# EAGLE design ESP_Bare_v2 (EAGLE 9.3.1)
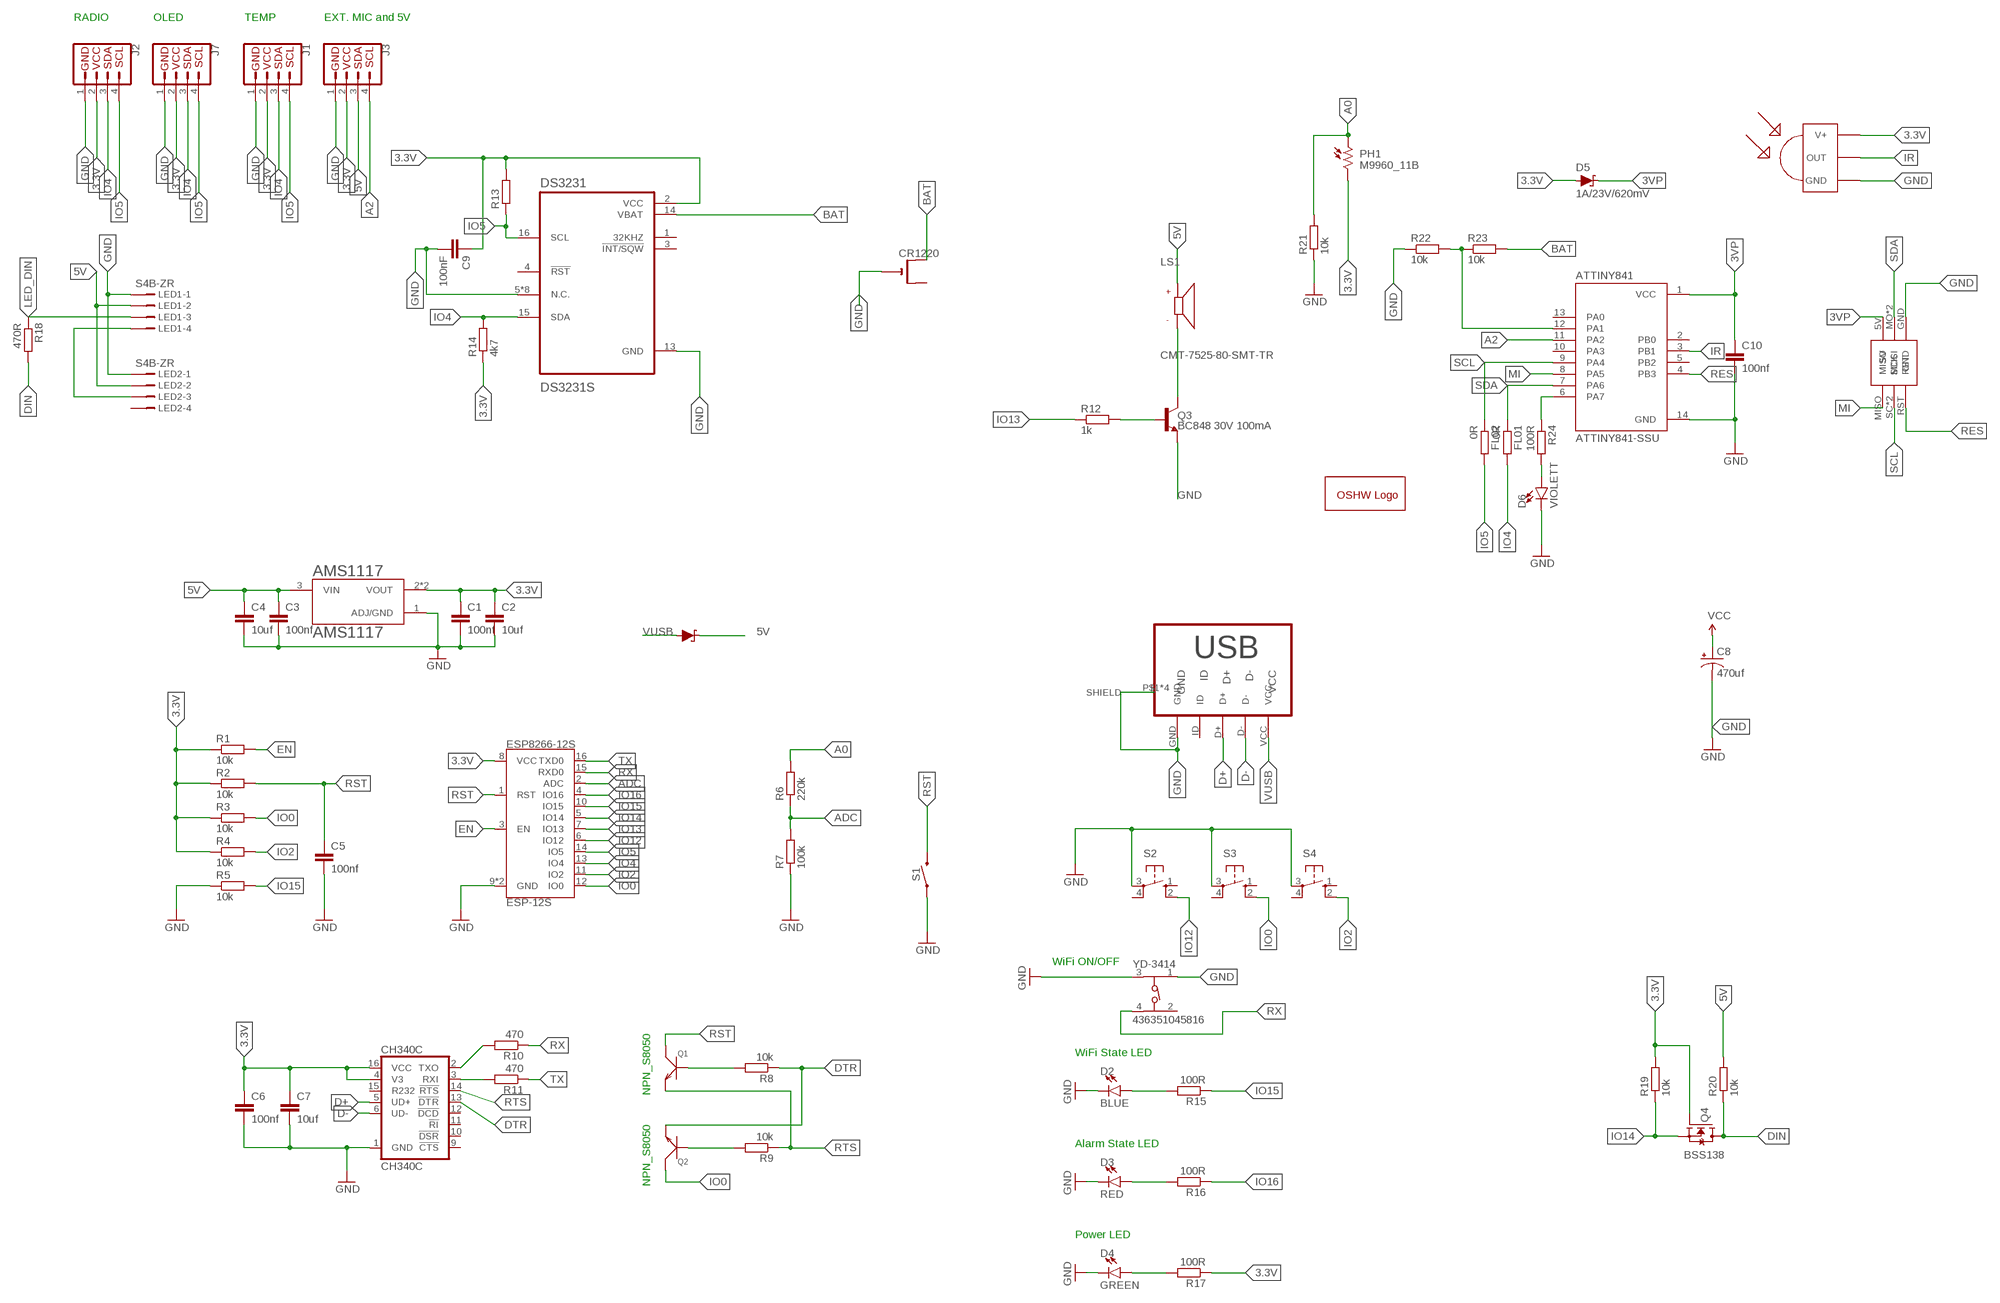
[diagram p0: schematic, sheet 1]

## Parts
AMS1117  AMS1117  [SOT229P700X180-4N]
ATTINY841  ATTINY841-SSU  [SOIC127P599X175-14N]
C1  100nf  C-EUC0603  [C0603]
C2  10uf  C-EUC0805  [C0805]
C3  100nf  C-EUC0603  [C0603]
C4  10uf  C-EUC0805  [C0805]
C5  100nf  C-EUC0603  [C0603]
C6  100nf  C-EUC0603  [C0603]
C7  10uf  C-EUC0603  [C0603]
C8  470uf  CAP_POL7343  [EIA7343]
C9  100nF  C-EUC0603  [C0603]
C10  100nf  C-EUC0603  [C0603]
CH340C  CH340C  [SO016]
CR1220  CR1220SMT  [CR1220-SMD]
D1  MBR130T1G, SL; SOD123 or SMA, 1A  DIODE-SCHOTTKY-B340A  [SMA-DIODE]
D2  BLUE  LED-BLUE0603  [LED-0603]
D3  RED  LED-BLUE0603  [LED-0603]
D4  GREEN  LED-BLUE0603  [LED-0603]
D5  1A/23V/620mV  DIODE-SCHOTTKY-BAT20J  [SOD-323]
D6  VIOLETT  LED-BLUE0603  [LED-0603]
DS3231  DS3231S  [SOIC127P1032X265-16N]
ESP8266-12S  ESP-12S  [ESP-12S]
FL01  0R  R-EU_R0603  [R0603]
FL02  0R  R-EU_R0603  [R0603]
GOLD_ORB_SM1  OSHWLOGOLOGO5MM  [OSHW_5MM]
J1  QWIIC_CONNECTORJS-1MM  [1X04_1MM_RA]
J2  QWIIC_CONNECTORJS-1MM  [1X04_1MM_RA]
J3  QWIIC_CONNECTORJS-1MM  [1X04_1MM_RA]
J7  QWIIC_CONNECTORJS-1MM  [1X04_1MM_RA]
LED1  S4B-ZR  [S4B-ZR]
LED2  S4B-ZR  [S4B-ZR]
LS1  CMT-7525-80-SMT-TR  [XDCR_CMT-7525-80-SMT-TR]
MICRO-USB  MICRO-USB-B  [MICRO_USB_4_LEGS]
PH1  M9960_11B  [M9960]
Q1  NPN_S8050  SMD-TRANSISTORS-NPN-25V-500MW(SOT-23)  [SOT-23]
Q2  NPN_S8050  SMD-TRANSISTORS-NPN-25V-500MW(SOT-23)  [SOT-23]
Q3  BC848 30V 100mA  TRANS_NPN-MMBT2222AL  [SOT23-3]
Q4  BSS138  [SOT95P240X111-3N]
R1  10k  R-EU_R0603  [R0603]
R2  10k  R-EU_R0603  [R0603]
R3  10k  R-EU_R0603  [R0603]
R4  10k  R-EU_R0603  [R0603]
R5  10k  R-EU_R0603  [R0603]
R6  220k  R-EU_R0603  [R0603]
R7  100k  R-EU_R0603  [R0603]
R8  10k  R-EU_R0603  [R0603]
R9  10k  R-EU_R0603  [R0603]
R10  470  R-EU_R0603  [R0603]
R11  470  R-EU_R0603  [R0603]
R12  1k  R-EU_R0603  [R0603]
R13  4k7  R-EU_R0603  [R0603]
R14  4k7  R-EU_R0603  [R0603]
R15  100R  R-EU_R0603  [R0603]
R16  100R  R-EU_R0603  [R0603]
R17  100R  R-EU_R0603  [R0603]
R18  470R  R-EU_R0603  [R0603]
R19  10k  R-EU_R0603  [R0603]
R20  10k  R-EU_R0603  [R0603]
R21  10k  R-EU_R0603  [R0603]
R22  10k  R-EU_R0603  [R0603]
R23  10k  R-EU_R0603  [R0603]
R24  100R  R-EU_R0603  [R0603]
S1  MOMENTARY-SWITCH-SPST-SMD-4.6X2.8MM  [TACTILE_SWITCH_SMD_4.6X2.8MM]
S2  10-XX  [B3F-10XX]
S3  10-XX  [B3F-10XX]
S4  10-XX  [B3F-10XX]
U$1  ISCP_PORTPOGONEW  [ISCP_PADS_2ROW2HNEW]
U$2  TSOP4838  [TSOP18XX]
YD-3414  436351045816  [4363X10458XX]

## Nets
3.3V: AMS1117.2(VOUT) AMS1117.4(VOUT) C1.1 C2.1 C6.1 C7.1 C9.1 CH340C.4(V3) CH340C.16(VCC) D5.A DS3231.2(VCC) ESP8266-12S.8(VCC) J1.2(VCC) J2.2(VCC) J3.2(VCC) J7.2(VCC) PH1.2 Q4.1(G) R1.1 R2.1 R3.1 R4.1 R13.2 R14.1 R17.1 R19.2 U$2.VCC(V+)
3VP: ATTINY841.1(VCC) C10.1 D5.C U$1.5V
5V: AMS1117.3(VIN) C3.1 C4.1 C8.A(+) D1.C J3.3(SDA) LED1.2 LED2.2 LS1.P R20.2 ; supply symbol labelled VCC
A0: PH1.1 R6.2 R21.2
A2: ATTINY841.11(PA2) J3.4(SCL)
ADC: ESP8266-12S.2(ADC) R6.1 R7.2
BAT: CR1220.+$1(+) DS3231.14(VBAT) R23.2
D+: CH340C.5(UD+) MICRO-USB.D+
D-: CH340C.6(UD-) MICRO-USB.D-
DIN: Q4.3(D) R18.2 R20.1
DTR: CH340C.13(!DTR) Q2.2(E) R8.1
EN: ESP8266-12S.3(EN) R1.2
GND: AMS1117.1(ADJ/GND) ATTINY841.14(GND) C1.2 C2.2 C3.2 C4.2 C5.2 C6.2 C7.2 C8.C(-) C9.2 C10.2 CH340C.1(GND) CR1220.- D2.C D3.C D4.C D6.C DS3231.5(N.C.) DS3231.6(N.C.) DS3231.7(N.C.) DS3231.8(N.C.) DS3231.9(N.C.) DS3231.10(N.C.) DS3231.11(N.C.) DS3231.12(N.C.) DS3231.13(GND) ESP8266-12S.9(GND) ESP8266-12S.P$1(GND) J1.1(GND) J2.1(GND) J3.1(GND) J7.1(GND) LED1.1 LED2.1 MICRO-USB.GND MICRO-USB.P$1(SHIELD) MICRO-USB.P$2(SHIELD) MICRO-USB.P$3(SHIELD) MICRO-USB.P$5(SHIELD) Q3.2(E) R5.1 R7.1 R21.1 R22.1 S1.1 S1.2 S2.3(P) S3.3(P) S4.3(P) U$1.GND U$2.GND YD-3414.1 YD-3414.3
IO0: ESP8266-12S.12(IO0) Q2.3(C) R3.2 S3.2(S1)
IO2: ESP8266-12S.11(IO2) R4.2 S4.2(S1)
IO4: DS3231.15(SDA) ESP8266-12S.13(IO4) FL01.2 J1.3(SDA) J2.3(SDA) J7.3(SDA) R14.2
IO5: DS3231.16(SCL) ESP8266-12S.14(IO5) FL02.2 J1.4(SCL) J2.4(SCL) J7.4(SCL) R13.1
IO12: ESP8266-12S.6(IO12) S2.2(S1)
IO13: ESP8266-12S.7(IO13) R12.1
IO14: ESP8266-12S.5(IO14) Q4.2(S) R19.1
IO15: ESP8266-12S.10(IO15) R5.2 R15.1
IO16: ESP8266-12S.4(IO16) R16.1
IR: ATTINY841.3(PB1) U$2.OUT
LED_DIN: LED1.3 R18.1
MI: ATTINY841.8(PA5) U$1.MISO
N$1: Q3.1(B) R12.2
N$2: LED1.4 LED2.3
N$3: Q1.1(B) R8.2
N$4: Q2.1(B) R9.2
N$5: ATTINY841.12(PA1) R22.2 R23.1
N$6: D6.A R24.2
N$7: ATTINY841.6(PA7) R24.1
N$8: D3.A R16.2
N$9: D2.A R15.2
N$10: D4.A R17.2
N$11: CH340C.3(RXI) R11.2
N$12: CH340C.2(TXO) R10.2
N$13: LS1.N Q3.3(C)
RES: ATTINY841.4(PB3) U$1.RST
RST: C5.1 ESP8266-12S.1(RST) Q1.3(C) R2.2 S1.3 S1.4
RTS: CH340C.14(!RTS) Q1.2(E) R9.1
RX: ESP8266-12S.15(RXD0) R10.1 YD-3414.4
SCL: ATTINY841.9(PA4) FL02.1 U$1.SC(SCK) U$1.SCK
SDA: ATTINY841.7(PA6) FL01.1 U$1.MO(MOSI) U$1.MOSI
TX: ESP8266-12S.16(TXD0) R11.1
VUSB: D1.A MICRO-USB.VCC
Unconnected: ATTINY841.2(PB0) ATTINY841.5(PB2) ATTINY841.10(PA3) ATTINY841.13(PA0) CH340C.9(!CTS) CH340C.10(!DSR) CH340C.11(!RI) CH340C.12(!DCD) CH340C.15(R232) CR1220.+$2(+1) DS3231.1(32KHZ) DS3231.3(!INT/SQW) DS3231.4(!RST) LED2.4 MICRO-USB.ID S2.1(S) S2.4(P1) S3.1(S) S3.4(P1) S4.1(S) S4.4(P1) YD-3414.2

## Notes on the sheet
- RADIO | OLED | TEMP | EXT. MIC and 5V
- WiFi ON/OFF
- NPN_S8050
- WiFi State LED
- NPN_S8050
- Alarm State LED
- Power LED

## Library data of the parts
AMS1117 = AMS1117:AMS1117: Sot223/Pkg 1-Amp 5-Volt Low Drop Out Voltage Regulatator; AVAILABILITY: Unavailable; DESCRIPTION: 1A LOW DROPOUT VOLTAGE REGULATOR SOT-223; MF: Advanced Monolithic Systems; MP: AMS1117; PACKAGE: SOT-223 Seeed Technology; PRICE: None
ATTINY841 = ATTINY841-SSU:ATTINY841-SSU: MCU 8-bit ATtiny AVR CISC 8KB Flash 1.8V/2.5V/3.3V/5V 14-Pin SOIC W Tray Check prices <https://pricing.snapeda.com/parts/ATTINY841-SSU/Microchip/view-part?ref=eda>; AVAILABILITY: Good; DESCRIPTION: AVR AVR® ATtiny Microcontroller IC 8-Bit 16MHz 8KB (8K x 8) FLASH 14-SOIC; MF: Microchip; MP: ATTINY841-SSU; PACKAGE: SOIC-14 Microchip; PRICE: None; PURCHASE-URL: https://pricing.snapeda.com/search/part/ATTINY841-SSU/?ref=eda
C1-C7 C9 C10 = resistor:C-EU: CAPACITOR, European symbol
C8 = SparkFun-Passives:CAP_POL: Capacitor Polarized These are standard SMD and PTH capacitors. Normally 10uF, 47uF, and 100uF in electrolytic and tantalum varieties. Always verify the external diameter of the through hole cap, it varies with capacity, voltage, and manufacturer. The EIA devices should be standard.
CH340C = CH340C:CH340C; AVAILABILITY: Unavailable; DESCRIPTION: USB to serial chip CH340; MF: WCH; MP: CH340C; PACKAGE: Package; PRICE: None
CR1220 = adafruit:CR1220: CR1216/CR1220/CR1225 12mm 3V lithium coin cell Great for battery packup. Both SMT and THM holders. Note the THM package has the ground pads on both sides of the PCB so that the masks are the same - this reduces the cost
D1 = SparkFun-DiscreteSemi:DIODE-SCHOTTKY: Schottky diode A Schottky diode is a semiconductor diode which has a low forward voltage drop and a very fast switching action.; PROD_ID: DIO-09886; VALUE: 3A/40V/500mV
D2 = SparkFun-LED:LED-BLUE: Blue SMD LED Used in manufacturing of various products at SparkFun Packages: 0603 - SMD 0603 package [Product Link] <http://www.digikey.com/product-detail/en/SMLE12BC7TT86/511-1589-2-ND/1641808> 1206 - SMD1206 package [Product Link] <http://www.digikey.com/product-detail/en/lite-on-inc/LTST-C150TBKT/160-1643-1-ND/573584> SparkFun Products: ESP8266 Thing-Dev Board <https://www.sparkfun.com/products/13711> RedBoard <https://www.sparkfun.com/products/12757>; PROD_ID: DIO-08575
D3 D4 D6 = SparkFun-LED:LED-BLUE: Blue SMD LED Used in manufacturing of various products at SparkFun Packages: 0603 - SMD 0603 package [Product Link] <http://www.digikey.com/product-detail/en/SMLE12BC7TT86/511-1589-2-ND/1641808> 1206 - SMD1206 package [Product Link] <http://www.digikey.com/product-detail/en/lite-on-inc/LTST-C150TBKT/160-1643-1-ND/573584> SparkFun Products: ESP8266 Thing-Dev Board <https://www.sparkfun.com/products/13711> RedBoard <https://www.sparkfun.com/products/12757>; PROD_ID: DIO-08575; VALUE: BLUE
D5 = SparkFun-DiscreteSemi:DIODE-SCHOTTKY: Schottky diode A Schottky diode is a semiconductor diode which has a low forward voltage drop and a very fast switching action.; PROD_ID: DIO-11623
DS3231 = DS3231S:DS3231S: Check prices <https://pricing.snapeda.com/parts/DS3231S/Maxim%20Integrated/view-part?ref=eda>; AVAILABILITY: Warning; DESCRIPTION: Real Time Clock (RTC) IC Clock/Calendar I²C, 2-Wire Serial 16-SOIC (0.295, 7.50mm Width); MF: Maxim Integrated; MP: DS3231S; PACKAGE: SOIC-16 Maxim Integrated; PRICE: None; PURCHASE-URL: https://pricing.snapeda.com/search/part/DS3231S/?ref=eda
ESP8266-12S = ESP-12S:ESP-12S: AI-Thinker ESP-12S ESP-12S WiFi module is developed by AI-Thinker Co.,Ltd, core processor ESP8266 in smaller sizes of the module encapsulates Tensilica L106 integrates industry-leading ultra low power 32-bit MCU micro, with the 16-bit short mode, clock speed support 80 MHz, 160 MHz, supports the RTOS, integrated Wi-Fi MAC/BB/RF/PA/LNA, on-board antennas. Check prices <https://pricing.snapeda.com/parts/ESP-12S/RF%20Solutions/view-part?ref=eda>; AVAILABILITY: Bad; DESCRIPTION: WiFi 802.11b/g/n Transceiver Module 2.412GHz ~ 2.484GHz PCB Trace Surface Mount; MF: RF Solutions; MP: ESP-12S; PACKAGE: Module RF Solutions; PRICE: None; PURCHASE-URL: https://pricing.snapeda.com/search/part/ESP-12S/?ref=eda
FL01 FL02 R12 R21-R24 = rcl:R-EU_: RESISTOR, European symbol; SPICEPREFIX: R
GOLD_ORB_SM1 = oshw:OSHWLOGO: The OSHW logo for PCB layout
J1-J3 J7 = SparkFun-Connectors:QWIIC_CONNECTOR: SparkFun I2C Standard Qwiic Connector An SMD 1mm pitch JST connector makes it easy and quick (get it? Qwiic?) to connect I2C devices to each other. The Qwiic system <http://www.sparkfun.com/qwiic> enables fast and solderless connection between popular platforms and various sensors and actuators. We carry 200mm <https://www.sparkfun.com/products/14204>, 100mm <https://www.sparkfun.com/products/14205>, 50mm <https://www.sparkfun.com/products/14206>, and breadboard friendly <https://www.sparkfun.com/products/14207> Qwiic cables. We also offer 10 pcs strips <https://www.sparkfun.com/products/14323> the SMD connectors.
LED1 LED2 = con-jst:?4B-ZR: ZH CONNECTOR 1.5 mm, 4 pin 1 row Source: http://www.jst.com .. eZH.pdf; MF: FARNELL; MPN: S4B-ZR(LF)(SN); OC_FARNELL: 9491830; OC_NEWARK: 38K8076
LS1 = CMT-7525-80-SMT-TR:CMT-7525-80-SMT-TR: CMT-7525-80-SMT-TR Check prices <https://pricing.snapeda.com/parts/CMT-7525-80-SMT-TR/CUI%20Devices/view-part?ref=eda>; AVAILABILITY: Good; CUI_PURCHASE_URL: https://www.cuidevices.com/product/audio/buzzers/audio-transducers/cmt-7525-80-smt-tr?utm_source=snapeda.com&utm_medium=referral&utm_campaign=snapedaBOM; DESCRIPTION: 7.5 mm, 3.6 Vo-p, 80 dB, Surface Mount (SMT), Magnetic Audio Transducer Buzzer; MF: CUI Devices; MP: CMT-7525-80-SMT-TR; PACKAGE: CUI Devices; PRICE: None; PURCHASE-URL: https://pricing.snapeda.com/search/part/CMT-7525-80-SMT-TR/?ref=eda
MICRO-USB = micro usb B - 4LEGS_ak:MICRO-USB-B
PH1 = photo-elements:M9960_11: Photo Sensor Beacon Light, Photometer Applications Source: http://optoelectronics.perkinelmer.com/content/Datasheets/DTS_M9960.pdf
Q1 Q2 = SMD-TRANSISTORS-NPN-25V-500MW_SOT-23_:SMD-TRANSISTORS-NPN-25V-500MW(SOT-23): 305010017 Check prices <https://pricing.snapeda.com/parts/S8050/Microdiode%20Electronics/view-part?ref=eda>; AVAILABILITY: Warning; DESCRIPTION: S8050; MF: Microdiode Electronics; MP: S8050; PACKAGE: None; PRICE: None
Q3 = SparkFun-DiscreteSemi:TRANS_NPN: NPN transistor Current controlled devices typically used to amplify current or used as a switch. BC547 - COM-08928 <http://www.sparkfun.com/products/8928> (TO-92 45V 100mA) (1.Collector 2.Base 3.Emitter) 2N3904 - COM-00521 <http://www.sparkfun.com/products/521> (TO-92 40V 200mA) (1.Emitter 2.Base 3.Collector) P2N2222A - COM-12852 <http://www.sparkfun.com/products/12852> (TO-92 40V 600mA) (1.Collector 2.Base 3.Emitter); PROD_ID: TRANS-08049; VALUE: 600mA/40V
Q4 = BSS138:BSS138: N-Channel 50V 220mA (Ta) 360mW (Ta) Surface Mount SOT-23-3 Check prices <https://pricing.snapeda.com/parts/BSS138/ON%20Semiconductor/view-part?ref=eda>; AVAILABILITY: Good; DESCRIPTION: N-Channel 50V 220mA (Ta) 360mW (Ta) Surface Mount SOT-23-3; MF: ON Semiconductor; MP: BSS138; PACKAGE: SOT-23 ON; PRICE: None; PURCHASE-URL: https://pricing.snapeda.com/search/part/BSS138/?ref=eda
R1-R11 R13-R20 = resistor:R-EU_: RESISTOR, European symbol
S1 = SparkFun-Switches:MOMENTARY-SWITCH-SPST: Momentary Switch (Pushbutton) - SPST Normally-open (NO) SPST momentary switches (buttons, pushbuttons). Variants PTH-12MM - 12mm square, through-hole Momentary Pushbutton Switch - 12mm Square <https://www.sparkfun.com/products/9190> (COM-09190) PTH-6.0MM, PTH-6.0MM-KIT - 6.0mm square, through-hole Mini Pushbutton Switch <https://www.sparkfun.com/products/97> (COM-00097) KIT package intended for soldering kit's - only one side of pads' copper is exposed. PTH-RIGHT-ANGLE-KIT - Right-angle, through-hole Right Angle Tactile Button <https://www.sparkfun.com/products/10791> - Used on SparkFun BigTime Watch Kit <https://www.sparkfun.com/products/11734> SMD-12MM - 12mm square, surface-mount Tactile Button - SMD (12mm) <https://www.sparkfun.com/products/12993> (COM-12993) Used on SparkFun PicoBoard <https://www.sparkfun.com/products/11888> SMD-4.5MM - 4.5mm Square Trackball Switch Used on SparkFun Blackberry Trackballer Breakout <https://www.sparkfun.com/products/13169> SMD-4.6MMX2.8MM - 4.60mm x 2.80mm, surface mount Used on SparkFun SAMD21 Mini Breakout <https://www.sparkfun.com/products/13664> SMD-5.2MM, SMD-5.2-REDUNDANT - 5.2mm square, surface-mount Mini Pushbutton Switch - SMD <https://www.sparkfun.com/products/8720> (COM-08720) Used on Arduino Pro Mini <https://www.sparkfun.com/products/11114> REDUNDANT package connects both switch circuits together SMD-6.0X3.5MM - 6.0 x 3.5mm, surface mount Momentary Reset Switch SMD <https://www.sparkfun.com/products/8229> (COM-08229) SMD-6.2MM-TALL - 6.2mm square, surface mount Tactile Button - SMD (6mm) <https://www.sparkfun.com/products/12992> Used on SparkFun Digital Sandbox <https://www.sparkfun.com/products/12651> SMD-RIGHT-ANGLE - Right-angle, surface mount Used on SparkFun Block for Intel® Edison - Arduino <https://www.sparkfun.com/products/13036>; PROD_ID: SWCH-13065
S2-S4 = switch-omron:10-XX: OMRON SWITCH; MPN: B3F-1000; OC_FARNELL: 176432; OC_NEWARK: 36M3542
U$1 = CoreDuino:ISCP_PORT
U$2 = TSOP4838:TSOP4838: IR Receiver and Demodulator Check prices <https://pricing.snapeda.com/parts/TSOP4838/Vishay/view-part?ref=eda>; AVAILABILITY: Good; DESCRIPTION: Remote Receiver Sensor, 38.0kHz 45m Through Hole; MF: Vishay; MP: TSOP4838; PACKAGE: DIP-3 Vishay; PRICE: None; PURCHASE-URL: https://pricing.snapeda.com/search/part/TSOP4838/?ref=eda
YD-3414 = Eagle_WS-TASU (rev21a):436351045816: WS-TASU SMT Tact Switch with Boss Design 4.7x3.5 mm side push MATERIAL PROPERTIES Cover Material:Stainless Steel PROPERTIES Actuator Material:PA46 Actuator Flammability Rating: UL94 HB Actuator Color: Black; White Frame Material: PA46 Frame Flammability: UL94 HB Frame Color:Black;White Contact Material Stainless Steel Contact Plating Silver Terminal Material Copper Alloy Terminal Plating Silver VR 12 V (DC) Contact Resistance Initial 100 mΩ Contact Resistance After Life Test 1 Ω RISO 100 MΩ Withstanding Voltage 250 V (AC) Washable No Qty. 3300 Mechanical Properties Stroke:0.25 mm; 0.3 mm GENERAL INFORMATION Operating Temperature -40 up to +85 °C Washable:No PACKAGING PROPERTIES Packaging Tape and Reel <https://www.we-online.com/catalog/media/o61089v209%20Family_WS_TUS_Normal_SMD_J-Bend_4363x10458xx_pf2.jpg> Details see: https://www.we-online.com/catalog/en/TASU_3_5X4_7_SMD_SIDE_PUSH_BOSS_DESIGN/ Updated by Yingchun, Shan 2020-02-17 2020(C) Wurth Elektronik; DATASHEET-URL: https://www.we-online.com/catalog/datasheet/436351045816.pdf; H: 1.65mm; OPERATION-FORCE: 160g; PART-NUMBER: 436351045816; QTY: 3300

## Net classes
0 default: width 0.305 mm, drill 0.305 mm, clearance 0.305 mm
2 medium: width 0.305 mm, drill 0.3 mm, clearance 0.305 mm

## Board
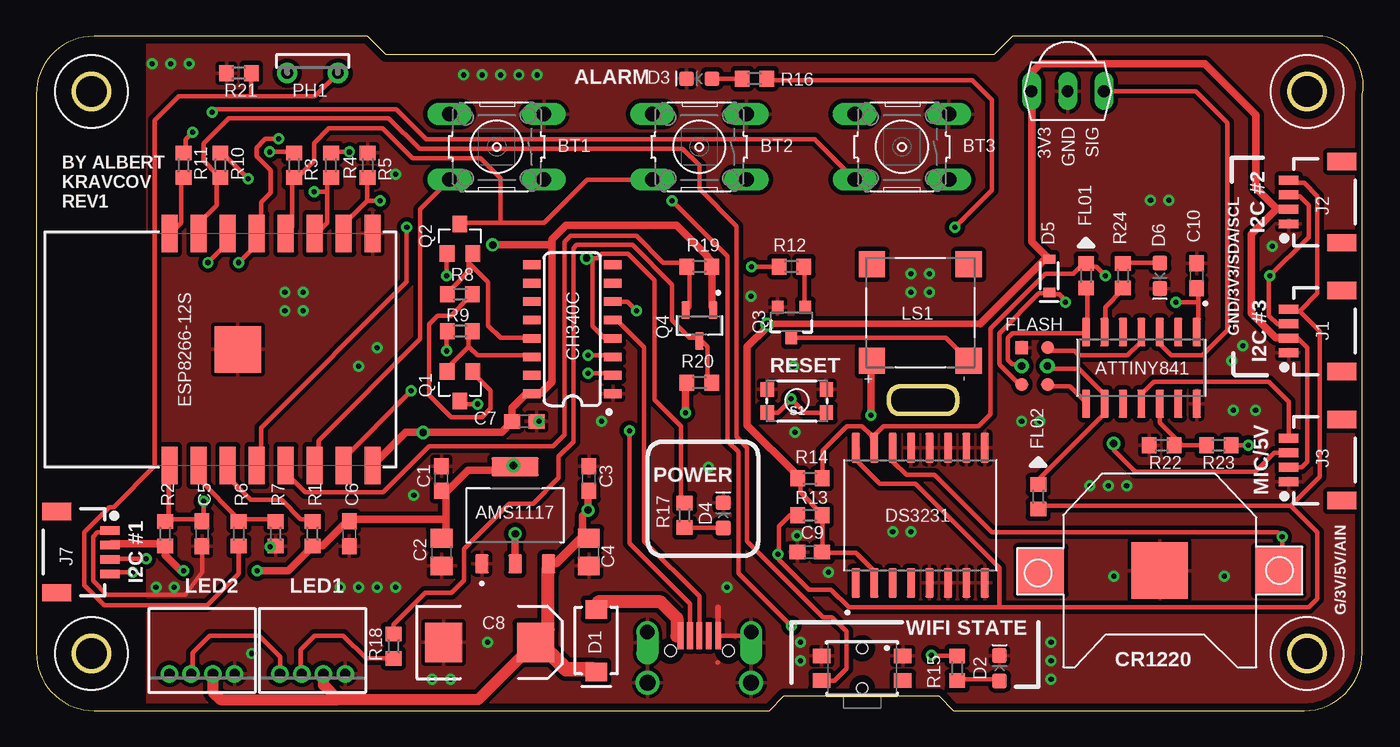
[diagram p1: board, top side]
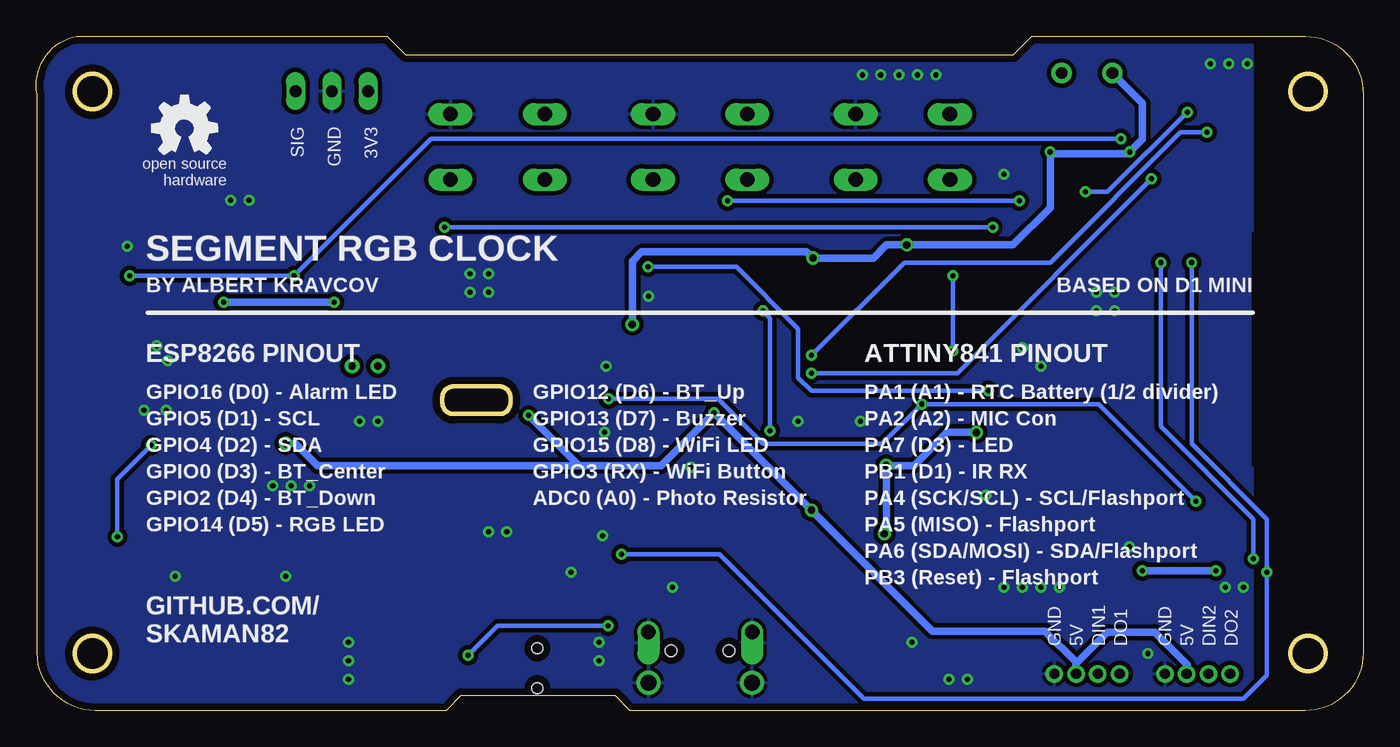
[diagram p2: board, bottom side, seen from below]

Size 91.5 x 46.48 mm. Coordinates in mm from the lower left corner, seen from the top.
Outline: 0,4 arc90 4,0 50.55,0 51.56,1.02 62.23,1.02 63.25,0 87.43,0 arc90 91.43,3.99 91.44,12.19 91.44,42.48 arc90 88.71,46.48 67.31,46.48 66.04,45.21 24.13,45.21 22.86,46.48 4,46.48 arc90 0,42.48 0,4
Outline: 63.5,21.21 63.5,21.59 arc90 62.74,22.35 59.56,22.35 arc90 58.8,21.59 58.8,21.21 arc90 59.56,20.45 62.74,20.45 arc90 63.5,21.21
Outline: circle at 3.81,42.67 radius 1.2
Outline: circle at 87.63,3.94 radius 1.2
Outline: circle at 87.63,42.67 radius 1.2
Outline: circle at 3.81,3.94 radius 1.2
Copper layers (1*16): Top 0.035mm / dielectric 1.5mm / Bottom 0.035mm
Design rules "default *": minimum track width 6mil, minimum drill 0.35mm, track to track 12mil, track to pad 12mil, pad to pad 12mil, via to via 12mil, smd to smd 12mil, copper to edge 20mil, drill to drill 6mil, minimum pad ring 10mil, minimum via ring 8mil, stop-mask expansion 4mil, vias tented up to drill 2mm, thermal gap 10mil

### Footprints (pad centres in the part's own frame; a part is rotated, then mirrored left to right if it is on the bottom)
SOT229P700X180-4N = smd 1.31 x 0.93: 1 -3.345,2.29; 2 -3.345,0; 3 -3.345,-2.29 | smd 1.31 x 3.24: 4 3.345,0
SOIC127P599X175-14N = smd 1.97 x 0.59: 1 -2.47,3.81; 2 -2.47,2.54; 3 -2.47,1.27; 4 -2.47,0; 5 -2.47,-1.27; 6 -2.47,-2.54; 7 -2.47,-3.81; 8 2.47,-3.81; 9 2.47,-2.54; 10 2.47,-1.27; 11 2.47,0; 12 2.47,1.27; 13 2.47,2.54; 14 2.47,3.81
C0603 = smd 1.1 x 1: 1 -0.85,0; 2 0.85,0
C0805 = smd 1.3 x 1.5: 1 -0.95,0; 2 0.95,0
EIA7343 = smd 2.55 x 2.7: A 3.17,0; C -3.17,0
SO016 = smd 0.6 x 1.2: 1 -4.445,-2.8; 2 -3.175,-2.8; 3 -1.905,-2.8; 4 -0.635,-2.8; 5 0.635,-2.8; 6 1.905,-2.8; 7 3.175,-2.8; 8 4.445,-2.8; 9 4.445,2.8; 10 3.175,2.8; 11 1.905,2.8; 12 0.635,2.8; 13 -0.635,2.8; 14 -1.905,2.8; 15 -3.175,2.8; 16 -4.445,2.8
CR1220-SMD = smd 3.2 x 3.2: +$1 -8.2,0; +$2 8.2,0 | smd 3.9 x 3.9: - 0,0
SMA-DIODE = smd 1.27 x 1.47: A -2.15,0; C 2.15,0
LED-0603 = smd 1 x 1: A -0.877,0; C 0.877,0
SOD-323 = smd 0.63 x 0.83: A 1.15,0; C -1.15,0
SOIC127P1032X265-16N = smd 2.05 x 0.59: 1 -4.655,4.445; 2 -4.655,3.175; 3 -4.655,1.905; 4 -4.655,0.635; 5 -4.655,-0.635; 6 -4.655,-1.905; 7 -4.655,-3.175; 8 -4.655,-4.445; 9 4.655,-4.445; 10 4.655,-3.175; 11 4.655,-1.905; 12 4.655,-0.635; 13 4.655,0.635; 14 4.655,1.905; 15 4.655,3.175; 16 4.655,4.445
ESP-12S = smd 2.6 x 1.1: 1 -8,3.5; 2 -8,1.5; 3 -8,-0.5; 4 -8,-2.5; 5 -8,-4.5; 6 -8,-6.5; 7 -8,-8.5; 8 -8,-10.5; 9 8,-10.5; 10 8,-8.5; 11 8,-6.5; 12 8,-4.5; 13 8,-2.5; 14 8,-0.5; 15 8,1.5; 16 8,3.5 | smd 3.2 x 3.2: P$1 0,-1.2
R0603 = smd 1 x 1.1: 1 -0.85,0; 2 0.85,0
1X04_1MM_RA = smd 0.6 x 1.35: 1 -1.5,0; 2 -0.5,0; 3 0.5,0; 4 1.5,0 | smd 1.2 x 2: NC1 2.8,-3.675; NC2 -2.8,-3.675
S4B-ZR = drill 0.7 pad 1.1: 1 -2.25,0; 2 -0.75,0; 3 0.75,0; 4 2.25,0
XDCR_CMT-7525-80-SMT-TR = smd 1.8 x 1.8: 1 3.329,3.329; 2 3.329,-3.329; N -3.329,-3.329; P -3.329,3.329
MICRO_USB_4_LEGS = smd 1.85 x 0.4: D+ 3.125,0; D- 3.125,0.65; GND 3.125,-1.3; ID 3.125,-0.65; VCC 3.125,1.3 | drill 1.1 pad 1.5: P$1 -0.1,3.575; P$2 -0.1,-3.575 | drill 1 pad 1.5 offset: P$3 3.4,3.575; P$5 3.4,-3.575 | hole 0.8: 2.1,2; 2.1,-2
M9960 = drill 0.8 pad 1.4: 1 -1.75,0; 2 1.75,0
SOT-23 = smd 1.016 x 1.143: 1 -0.889,-1.016; 2 0.889,-1.016; 3 0,1.016
SOT23-3 = smd 0.8 x 0.9: 1 -0.95,-1; 2 0.95,-1; 3 0,1.1
SOT95P240X111-3N = smd 1.23 x 0.6: 1 -1.06,0.95; 2 -1.06,-0.95; 3 1.06,0
TACTILE_SWITCH_SMD_4.6X2.8MM = smd 0.9 x 1: 1 -2.05,-0.8; 2 2.05,-0.8; 3 2.05,0.8; 4 -2.05,0.8
B3F-10XX = drill 1.016 long: 1 -3.251,2.261; 2 3.251,2.261; 3 -3.251,-2.261; 4 3.251,-2.261
ISCP_PADS_2ROW2HNEW = smd 0.889 x 0.889: 5V -1.27,1.778; GND 1.27,1.778; MISO -1.27,0; MOSI 0,1.778; RST 1.27,0; SCK 0,0 | drill 0.508 pad 0.889: MO 0,1.778; SC 0,0
TSOP18XX = drill 0.813 long: GND -0.001,-0.027; OUT -2.501,-0.027; VCC 2.499,-0.027
4363X10458XX = smd 1.2 x 1: 1 2.8,0.85; 2 2.8,-0.85; 3 -2.8,0.85; 4 -2.8,-0.85 | hole 0.75: 0,1.375; 0,-1.375

### Placement (x,y rotation side)
AMS1117  33.02,13.46 90 top
ATTINY841  76.2,23.62 270 top
C1  27.94,16 90 top
C2  27.94,10.92 270 top
C3  38.1,16 90 top
C4  38.1,10.92 270 top
C5  11.43,12.19 270 top
C6  21.59,12.19 270 top
C7  33.65,19.94 0 top
C8  31.24,4.7 0 top
C9  53.34,10.92 180 top
C10  80.01,29.97 90 top
CH340C  36.96,26.29 90 top
CR1220  77.47,9.65 180 top
D1  38.61,4.83 270 top
D2  66.42,2.92 90 top
D3  45.72,43.56 180 top
D4  47.37,13.46 90 top
D5  69.85,29.97 90 top
D6  77.47,29.97 270 top
DS3231  60.96,13.46 90 top
ESP8266-12S  12.7,24.89 90 top
FL01  72.39,29.97 90 top
FL02  69.09,14.73 270 top
GOLD_ORB_SM1  81.28,40.13 0 bottom
J1  86.36,26.16 90 top
J2  86.36,35.05 90 top
J3  86.36,17.27 90 top
J7  5.08,10.92 270 top
LED1  19.05,2.54 180 top
LED2  11.43,2.54 180 top
LS1  60.96,27.43 90 top
MICRO-USB  45.72,2.03 90 top
PH1  19.05,43.94 180 top
Q1  29.21,22.35 180 top
Q2  29.21,32.51 0 top
Q3  52.07,26.8 180 top
Q4  45.72,26.54 270 top
R1  19.05,12.19 90 top
R2  8.89,12.19 90 top
R3  17.78,37.59 270 top
R4  20.32,37.59 270 top
R5  22.86,37.59 270 top
R6  13.97,12.19 270 top
R7  16.51,12.19 90 top
R8  29.21,28.7 0 top
R9  29.21,26.16 180 top
R10  12.7,37.59 90 top
R11  10.16,37.59 90 top
R12  52.07,30.61 0 top
R13  53.34,13.46 0 top
R14  53.34,16 0 top
R15  63.5,2.92 270 top
R16  49.53,43.56 180 top
R17  44.7,13.46 270 top
R18  24.64,4.45 90 top
R19  45.72,30.61 0 top
R20  45.72,22.61 180 top
R21  13.97,43.94 0 top
R22  77.6,18.29 0 top
R23  81.53,18.29 0 top
R24  74.93,29.97 90 top
S1  52.45,21.34 180 top
S2  31.75,38.86 180 top
S3  45.72,38.86 180 top
S4  59.69,38.86 180 top
U$1  69.72,23.75 90 top
U$2  71.12,42.67 180 top
YD-3414  56.95,2.92 0 top

### Tracks (layer width: path | path; a pad name or v marks a point on that pad's centre or on a via)
3.3V  (via drill 0.35, 0.51)
  Top 0.305: DS3231.2 57.81,8.83 57.81,9.6 56.51,10.9 54.19,10.9 C9.1 54.2,11.07 54.2,13.21 R13.2 54.2,13.51 52.68,15.04 52.68,15.95 R14.1 52.38,16.26 52.38,16.33 | 86.21,25.7 J1.2 86.37,25.67 86.97,25.67 87.63,25.01 87.63,17.15 87.25,16.76 86.37,16.76 J3.2 | J2.2 86.21,34.54 85.6,34.54 85.54,34.61 | 50.63,26.68 50.65,26.7 | 69.67,31.24 D5.A | 28.25,12.57 C2.1 | 19.15,11.38 R1.1 | 21.59,13.21 C6.1 | 28.25,15.04 27.99,14.78 27.99,15.04 C1.1 | 32.87,16.56 AMS1117.4 | 38.34,31.19 38.34,26.51 39.19,25.65 CH340C.4 | R17.1 44.45,14.48 44.45,19.61 42.62,21.44 42.62,29.67 40.79,31.5 38.96,31.5 38.66,31.19 38.34,31.19 | 46.58,30.58 R19.2 46.57,30.99 | 46.58,27.84 Q4.1 | 23.42,17.17 ESP8266-12S.8 | 46.28,31.32 46.28,31.27 | 34.28,21.84 CH340C.16 | 8.44,11.51 R2.1 8.89,10.71 | v16.1,38.51 17.63,38.51 R3.1 | v21.59,38.51 20.37,38.51 R4.1 | v37.95,31.19 38.34,31.19 | v50.39,26.62 50.39,26.44 | 26.57,19.08 26.67,19.08 | 35.43,32.11 35.43,32.36 35.56,32.49
  Top 0.457: 65.11,26.68 50.63,26.68
  Top 0.508: 86.21,25.7 85.47,25.7 83.77,27.41 83.77,32.84 85.54,34.61 84.1,36.04 84.1,41.07 80.57,44.6 69.24,44.6 68.62,43.98 U$2.VCC 68.66,42.66 68.66,32.32 D5.A | 52.38,16.33 49.02,19.69 49.02,25.07 50.39,26.44 50.65,26.7 | 69.67,31.24 65.11,26.68 | 28.25,12.57 28.25,13.21 | 28.25,13.21 28.25,15.04 29.77,16.56 32.87,16.56 | 19.15,11.38 19.76,11.38 21.59,13.21 28.25,13.21 | 46.58,27.84 46.58,30.58 | 26.8,19.2 25.45,19.2 23.42,17.17 | 26.67,19.08 26.8,19.2 | 46.28,31.32 44.14,33.45 36.52,33.45 35.56,32.49 35.56,22.66 34.77,21.87 | 34.77,21.87 | 46.57,30.99 46.28,31.27 | 8.44,11.51 5.16,11.51 J7.2 | v31.47,32.11 35.43,32.11 | v26.67,19.18 26.57,19.08 | v10.16,9.65 9.95,9.65 8.89,10.71 | R1.1 17.36,9.65 v15.24,9.65 | v33.02,12.19 AMS1117.2 | AMS1117.4 32.94,16.89 v32.89,16.89 | 26.8,19.2 32.07,19.2 C7.1 32.8,20.87 33.78,21.84 CH340C.16 34.18,21.87 34.77,21.87
  Bottom 0.508: v50.39,26.62 50.39,30.99 49.76,31.62 38.38,31.62 v37.95,31.19 33.78,31.19 32.87,32.11 v31.47,32.11 24.16,32.11 21.59,34.67 v21.59,38.51 21.46,38.38 16.23,38.38 v16.1,38.51 15.21,39.39 15.21,41.86 PH1.2 | v26.67,19.18 28.7,19.18 30.99,16.89 v32.89,16.89 32.89,12.32 v33.02,12.19 | v10.16,9.65 v15.24,9.65
3VP  (via drill 0.35)
  Top 0.305: 80.11,28.14 80.11,26.31 ATTINY841.1 | 80.11,28.14 80.11,29.06 C10.1 | U$1.5V 67.92,22.35 66.4,23.88 66.4,26.01 69.14,28.75 69.75,28.75 D5.C 69.98,28.7 70.54,28.7 70.97,28.27 v70.97,28.14 | v78.59,28.14 80.11,28.14
  Bottom 0.508: v70.97,28.14 v78.59,28.14
5V  (via drill 0.35, 0.51)
  Top 0.305: C4.1 37.98,11.99 37.67,11.99 | 38.05,15.04 C3.1 | 38.35,2.84 D1.C | 34.7,4.67 C8.A 34.7,4.98 35.31,5.59 | 35.31,9.86 AMS1117.3 | 44.75,22.35 R20.2 | 57.56,23.88 LS1.P | J3.3 85.87,17.77 85.86,17.78 85.37,17.78 84.05,16.47 75.78,16.47 74.3,17.95 v74.3,18.41
  Top 0.508: 37.67,11.99 37.67,13.44 v38.05,13.82 38.05,15.04 | v44.75,20.52 44.75,22.35 | v57.56,20.34 57.56,23.88
  Top 0.635: 37.67,11.99 35.84,10.16 35.61,10.16 AMS1117.3
  Top 0.762: C8.A 30.48,0.76 20.82,0.76 | 20.82,0.76 19.8,1.78 LED1.2 | LED2.2 12.18,1.28 12.7,0.76 20.82,0.76
  Top 0.889: 35.31,5.59 35.31,9.86
  Top 1.016: 38.35,2.84 36.52,2.84 34.7,4.67
  Bottom 0.305: 19.8,3.34 19.75,3.29
  Bottom 0.508: LED1.2 19.8,3.34 | 54.08,16.87 48.41,16.87 v44.75,20.52 v38.05,13.82 29.71,5.48 21.94,5.48 19.75,3.29 17.63,5.41 14.38,5.41 12.14,3.17 12.14,2.58 LED2.2 | 54.08,16.87 v57.56,20.34 | 54.08,16.87 72.11,16.87 73.66,18.41 v74.3,18.41
A0
  Top 0.305: R6.2 13.97,9.45 11.79,7.26 4.67,7.26 3.3,8.64 3.3,12.29 5.03,14.02 5.33,14.02 8.18,16.87 8.18,40.69 9.83,42.34 14.86,42.34 | PH1.1 19.2,42.34 14.86,42.34 | R21.2 14.82,42.38 14.86,42.34
A2
  Top 0.305: J3.4 86.36,21.29 84.99,22.66 77.06,22.66 76.2,21.79 ATTINY841.11
ADC
  Top 0.305: 13.97,13.21 16.41,13.21 R7.2 | 13.97,13.21 11.23,15.95 11.23,16.87 ESP8266-12S.2 | 13.97,13.21 R6.1
BAT  (via drill 0.35)
  Top 0.305: CR1220.+$1 85.9,9.82 v85.9,11.99 85.6,12.29 65.89,12.29 61.92,16.26 59.99,16.26 59.08,17.17 59.08,18.09 DS3231.14 | v83.57,18.29 R23.2
  Bottom 0.305: v83.57,18.29 85.9,15.95 v85.9,11.99
D+
  Top 0.305: MICRO-USB.D+ 45.72,7.87 41.91,11.68 41.91,25.05 40.03,26.92 CH340C.5
D-  (via drill 0.35)
  Top 0.305: MICRO-USB.D- 45.07,7.37 40.9,11.54 40.9,17.27 40.89,17.28 v40.89,19.3 | v41.4,27.56 40.77,28.19 CH340C.6
  Bottom 0.305: v40.89,19.3 40.89,27.05 v41.4,27.56
DIN
  Top 0.305: R18.2 24.64,5.94 26.82,8.13 28.65,8.13 29.52,8.99 29.52,11.15 32.61,14.25 34.24,14.25 36.03,16.04 36.03,17.54 37.03,18.54 37.03,31.88 37.26,32.11 41.1,32.11 43.84,29.36 43.84,26.92 45.06,25.7 45.67,25.7 Q4.3 45.97,25.4 46.28,25.09 46.28,22.66 R20.1
DTR
  Top 0.305: 29.82,30.89 29.82,31.5 Q2.2 | 29.82,30.89 29.82,30.28 28.6,29.06 28.6,28.75 R8.1 | 29.82,30.89 31.17,29.54 31.17,26.54 32,25.7 34.09,25.7 CH340C.13
EN
  Top 0.305: R1.2 18.85,13.21 18.24,13.21 16.92,14.53 14.78,14.53 13.36,15.95 13.36,16.87 ESP8266-12S.3
GND  (via drill 0.35)
  Top 0.305: J7.1 4.83,12.29 4.22,12.29 3.91,11.99 3.91,8.94 4.85,8 10.27,8 11.43,9.53 C5.2 | 47.02,3.33 46.99,3.3 | MICRO-USB.GND 46.99,5.19 46.99,5.84 47.02,5.81 MICRO-USB.GND | MICRO-USB.GND 49.02,5.16 MICRO-USB.P$5
  Top 0.381: MICRO-USB.GND 47.02,7.11
  other vias: 26.04,14.86 22.23,8.51 23.5,8.51 24.77,8.51 22.23,23.75 23.5,25.02 17.14,28.83 18.41,28.83 17.14,27.56 18.41,27.56 8,44.58 32,43.81 24.77,36.96 46.35,16.76 47.62,8.51 52.7,4.7 52.7,3.43 59.05,12.32 60.32,12.32 69.22,19.94 67.95,19.94 69.98,3.43 69.98,4.7 69.98,2.16 60.32,28.83 60.32,30.1 61.59,30.1 61.59,28.83 82.42,24.13 84.07,20.7 82.55,20.7 85.22,32 76.84,35.18 78.11,35.18 83.19,25.15 8.26,8.51 9.53,8.51 20.96,8.51 16.13,11.3 54.61,9.52 52.45,12.06 52.32,19.18 52.2,23.75 49.28,28.58 81.92,9.27 75.18,15.49 73.91,15.49 72.64,15.49 74.3,9.27 31.11,4.7 27.3,2.16 28.57,2.16 14.86,3.94 10.54,44.58 9.27,44.58 33.27,43.81 34.54,43.81 30.73,43.81 29.46,43.81 34.67,19.94 38.99,19.94
  pour Top: 7.62,51.56 7.62,-5.59 109.22,-5.59 109.22,51.56
  pour Bottom: 7.62,52.83 7.62,-4.32 107.95,-4.32 107.95,52.83
  pour Bottom: 7.62,52.83 7.62,-4.32 107.95,-4.32 107.95,52.83
IO0
  Top 0.305: ESP8266-12S.12 17.32,33.02 17.63,33.33 17.63,36.68 R3.2 17.93,36.98 18.24,36.98 19.15,37.9 19.15,39.12 20.17,40.13 23.88,40.13 25.93,38.08 30.63,38.08 32,36.7 32,33.63 | 32,33.63 35,33.63 37.97,36.6 S3.2 | 32,33.63 29.21,33.63 Q2.3
IO2  (via drill 0.35)
  Top 0.305: 20.07,35.76 20.07,33.63 19.46,33.02 ESP8266-12S.11 | 20.07,35.76 20.07,36.68 R4.2 | 20.07,35.76 v19.15,35.76 | S4.2 53.78,39.26 53.71,39.38 26.88,39.38 24.81,41.45 12.37,41.45 12.17,41.25 v12.14,41.25
  Bottom 0.305: v12.14,41.25 17.63,35.76 v19.15,35.76
IO4  (via drill 0.35)
  Top 0.305: v7.57,10.47 5.13,10.47 J7.3 | v13.97,30.89 15.19,32.11 15.19,32.72 ESP8266-12S.13 15.49,33.02 15.49,35.05 16.15,35.71 16.15,37.24 15.19,38.2 15.19,38.81 15.8,39.42 v16.71,39.42 | 84.99,29.9 84.99,29.97 v85.06,29.97 | 84.99,29.9 84.99,27.23 85.6,26.62 86.21,26.62 J1.3 | 84.99,29.9 87.73,32.64 87.73,34.85 87.12,35.46 86.51,35.46 J2.3 | 57.68,18.51 57.68,18.24 DS3231.15 57.68,18.51 | R14.2 54.2,16.26 54.2,17.91 55.9,19.61 56.95,19.61 57.56,19 57.61,18.8 | 57.61,18.8 58.42,19.61 64.97,19.61 65.79,20.42 65.79,26.31 69.57,30.1 71.5,30.1 71.98,30.58 72.19,30.58 FL01.2 72.49,30.58 73.1,30.58 v73.71,29.97 | 57.61,18.8 57.68,18.51
  Bottom 0.305: v7.57,10.47 7.57,13.21 13.97,19.61 v13.97,30.89 | v85.06,29.97 v73.71,29.97 64.26,39.42 v16.71,39.42
IO5  (via drill 0.35)
  Top 0.305: v6.65,9.55 5.13,9.55 J7.4 | v11.84,30.89 13.06,32.11 13.06,32.72 ESP8266-12S.14 | R13.1 51.97,13.46 51.21,12.7 51.21,10.77 | 51.21,10.77 51.21,10.41 53.29,8.33 54.81,8.33 56.03,7.11 66.29,7.11 | 66.29,7.11 66.4,7.21 66.4,9.86 60.6,15.65 58.17,15.65 56.64,17.17 56.64,18.09 DS3231.16 | 86.51,14.12 69.29,14.12 FL02.2 | 86.51,14.12 88.49,16.1 88.49,26.16 87.12,27.53 | 87.12,27.53 86.51,27.53 J1.4 | 87.12,27.53 88.34,28.75 88.34,35.46 87.43,36.37 86.51,36.37 J2.4 | 66.29,7.11 87.73,7.11 88.34,7.72 88.34,12.29 86.51,14.12 | 51.21,10.77 v51.16,10.77
  Bottom 0.305: v11.84,30.89 11.84,18.39 6.65,13.21 v6.65,9.55 6.65,2.44 8.28,0.81 34.44,0.81 44.4,10.77 v51.16,10.77
IO12
  Top 0.305: S2.2 26.47,34.57 26.47,25.63 19.46,18.62 19.46,17.17 ESP8266-12S.6
IO13  (via drill 0.35)
  Top 0.305: v49.33,30.58 51.16,30.58 R12.1 | v25.86,22.05 20.98,17.17 ESP8266-12S.7
  Bottom 0.305: v49.33,30.58 43.23,30.58 38.96,26.31 38.96,22.96 38.05,22.05 v25.86,22.05
IO14
  Top 0.305: Q4.2 45.06,27.84 45.06,30.58 R19.1 44.75,30.89 43.23,30.89 41.4,32.72 36.83,32.72 36.42,32.31 36.42,19 35.64,18.21 27.08,18.21 23.9,15.04 18.54,15.04 17.32,16.26 17.32,16.87 ESP8266-12S.5
IO15  (via drill 0.35)
  Top 0.305: 22.81,35.15 22.81,36.68 R5.2 | 22.81,35.15 21.29,33.63 21.29,33.02 ESP8266-12S.10 | v43.84,35.15 47.68,31.32 47.68,18.57 48.41,17.83 48.41,9.47 52.07,5.82 v52.07,5.84 | 22.81,35.15 v23.72,35.15 | v61.72,3.81 61.81,3.81 61.85,3.77 R15.1
  Bottom 0.305: v23.72,35.15 v43.84,35.15 | v52.07,5.84 59.69,5.84 v61.72,3.81
IO16  (via drill 0.35)
  Top 0.305: v63.35,33.33 65.89,35.86 65.89,42.1 64.55,43.43 50.51,43.43 R16.1 | v25.55,33.33 25.55,29.57 15.49,19.51 15.49,17.17 ESP8266-12S.4
  Bottom 0.305: v25.55,33.33 v63.35,33.33
IR
  Top 0.305: ATTINY841.3 77.42,26.04 77.42,25.35 78.28,24.49 80.42,24.49 82.14,26.21 82.14,40.53 79.97,42.7 U$2.OUT
LED_DIN
  Top 0.305: R18.1 22.73,3.59 21.17,5.16 19.2,5.16 18.24,4.19 18.24,2.6 LED1.3
MI
  Top 0.305: U$1.MISO 69.75,22.35 71.27,22.35 72.19,21.44 ATTINY841.8
N$1
  Top 0.305: Q3.1 52.98,27.84 52.98,30.58 R12.2
N$2
  Top 0.305: LED1.4 16.8,3.72 15.37,5.16 11.96,5.16 10.79,3.99 10.79,2.54 LED2.3
N$3
  Top 0.305: R8.2 29.82,28.45 28.6,27.23 27.69,27.23 27.08,26.62 27.08,21.74 28.6,20.22 30.73,20.22 31.34,20.83 31.34,22.05 30.12,23.27 Q1.1
N$4  (via drill 0.35)
  Top 0.305: v28.3,24.79 28.3,26.01 R9.2 | v28.3,29.97 28.3,31.5 Q2.1
  Bottom 0.305: v28.3,29.97 v28.3,24.79
N$5
  Top 0.305: ATTINY841.12 77.48,19.84 79.03,18.29 | 79.03,18.29 R23.1 | R22.2 79.03,18.29
N$6
  Top 0.305: D6.A 77.37,30.89 74.93,30.89 R24.2
N$7
  Top 0.305: R24.1 74.93,29.03 73.71,27.81 73.71,26.31 ATTINY841.6
N$8
  Top 0.305: R16.2 D3.A
N$9
  Top 0.305: D2.A 66.4,2.16 63.65,2.16 R15.2
N$10
  Top 0.305: D4.A 47.34,12.61 R17.2
N$11  (via drill 0.35)
  Top 0.305: v10.79,39.85 10.31,39.37 10.31,38.51 R11.2 | v38.05,24.49 39.57,24.49 CH340C.3
  Bottom 0.305: v10.79,39.85 12.62,39.85 21.59,30.89 31.65,30.89 v38.05,24.49
N$12  (via drill 0.35)
  Top 0.305: v14.61,36.65 13.06,38.2 12.75,38.2 R10.2 | v38.05,23.27 39.57,23.27 CH340C.2
  Bottom 0.305: v14.61,36.65 27.99,23.27 v38.05,23.27
N$13
  Top 0.305: Q3.3 52.07,25.7 62.74,25.7 64.26,24.18 LS1.N
RES
  Top 0.305: U$1.RST 69.75,24.79 71.58,24.79 71.88,24.49 75.23,24.49 76.15,25.4 76.15,26.01 ATTINY841.4
RST  (via drill 0.35)
  Top 0.305: S1.3 51.14,20.54 52.04,21.44 v52.04,21.49 53,20.54 S1.4 | 9.4,13.21 11.23,13.21 C5.1 11.53,13.21 v11.53,14.43 | 9.4,13.21 9.14,13.21 | 9.14,13.21 9.09,13.21 R2.2 9.4,13.21 | v30.43,21.13 29.21,21.13 Q1.3 | ESP8266-12S.1 9.14,16.84 9.14,13.21
  Bottom 0.305: v11.53,14.43 18.24,21.13 v30.43,21.13 33.17,18.39 41.4,18.39 44.5,21.49 v52.04,21.49
RTS
  Top 0.305: 29.82,25.09 29.82,26.01 R9.1 | 29.82,25.09 28.3,23.57 Q1.2 | 29.82,25.09 30.43,24.49 34.09,24.49 CH340C.14
RX
  Top 0.305: ESP8266-12S.15 11.23,33.02 11.23,33.63 12.45,34.85 12.45,36.68 R10.1 12.45,36.98 11.53,37.9 11.53,39.12 13.26,40.84 24.31,40.84 26.42,38.73 44.58,38.73 45.72,37.59 45.72,35.97 48.28,33.4 48.28,18.87 49.02,18.14 49.02,11.68 54.25,6.45 54.86,6.45 55.86,5.45 55.86,2.9 55.03,2.07 YD-3414.4
SCL
  Top 0.305: FL02.1 69.16,15.61 69.16,15.98 73.66,20.47 ATTINY841.9 73.66,21.79 71.88,23.57 69.75,23.57 U$1.SC
SDA
  Top 0.305: FL01.1 72.49,29.06 72.49,26.31 ATTINY841.7 72.19,26.01 67.31,26.01 67.01,25.7 67.01,24.18 67.31,23.88 67.92,23.88 U$1.MO
TX
  Top 0.305: R11.1 10.01,36.68 10.01,33.63 9.4,33.02 ESP8266-12S.16
VUSB
  Top 0.305: MICRO-USB.VCC 44.17,5.16 | 38.74,7.49 38.61,7.36 D1.A
  Top 0.889: 44.17,5.16 44.17,6.38 43.05,7.49 38.74,7.49

### Text on the board
tNames: ALARM | 3V3 | GND | SIG | BT1 | BT2 | BT3 | BY ALBERT / KRAVCOV / REV1 | GND/3V3/SDA/SCL | I2C #2 | FLASH | I2C #3 | RESET | POWER | MIC/5V | I2C #1 | G/3V/5V/AIN | WIFI STATE
bNames: 3V3 | GND | SIG | SEGMENT RGB CLOCK | BASED ON D1 MINI | BY ALBERT KRAVCOV | ATTINY841 PINOUT | ESP8266 PINOUT | PA1 (A1) - RTC Battery (1/2 divider) / PA2 (A2) - MIC Con / PA7 (D3) - LED / PB1 (D1) - IR RX / PA4 (SCK/SCL) - SCL/Flashport / PA5 (MISO) - Flashport / PA6 (SDA/MOSI) - SDA/Flashport / PB3 (Reset) - Flashport | GPIO12 (D6) - BT_Up / GPIO13 (D7) - Buzzer / GPIO15 (D8) - WiFi LED / GPIO3 (RX) - WiFi Button / ADC0 (A0) - Photo Resistor | GPIO16 (D0) - Alarm LED / GPIO5 (D1) - SCL / GPIO4 (D2) - SDA / GPIO0 (D3) - BT_Center / GPIO2 (D4) - BT_Down / GPIO14 (D5) - RGB LED | GITHUB.COM/ / SKAMAN82 | DO2 | DIN2 | 5V | GND | DO1 | DIN1 | 5V | GND